# Altium project Control Board V2.PrjPcb
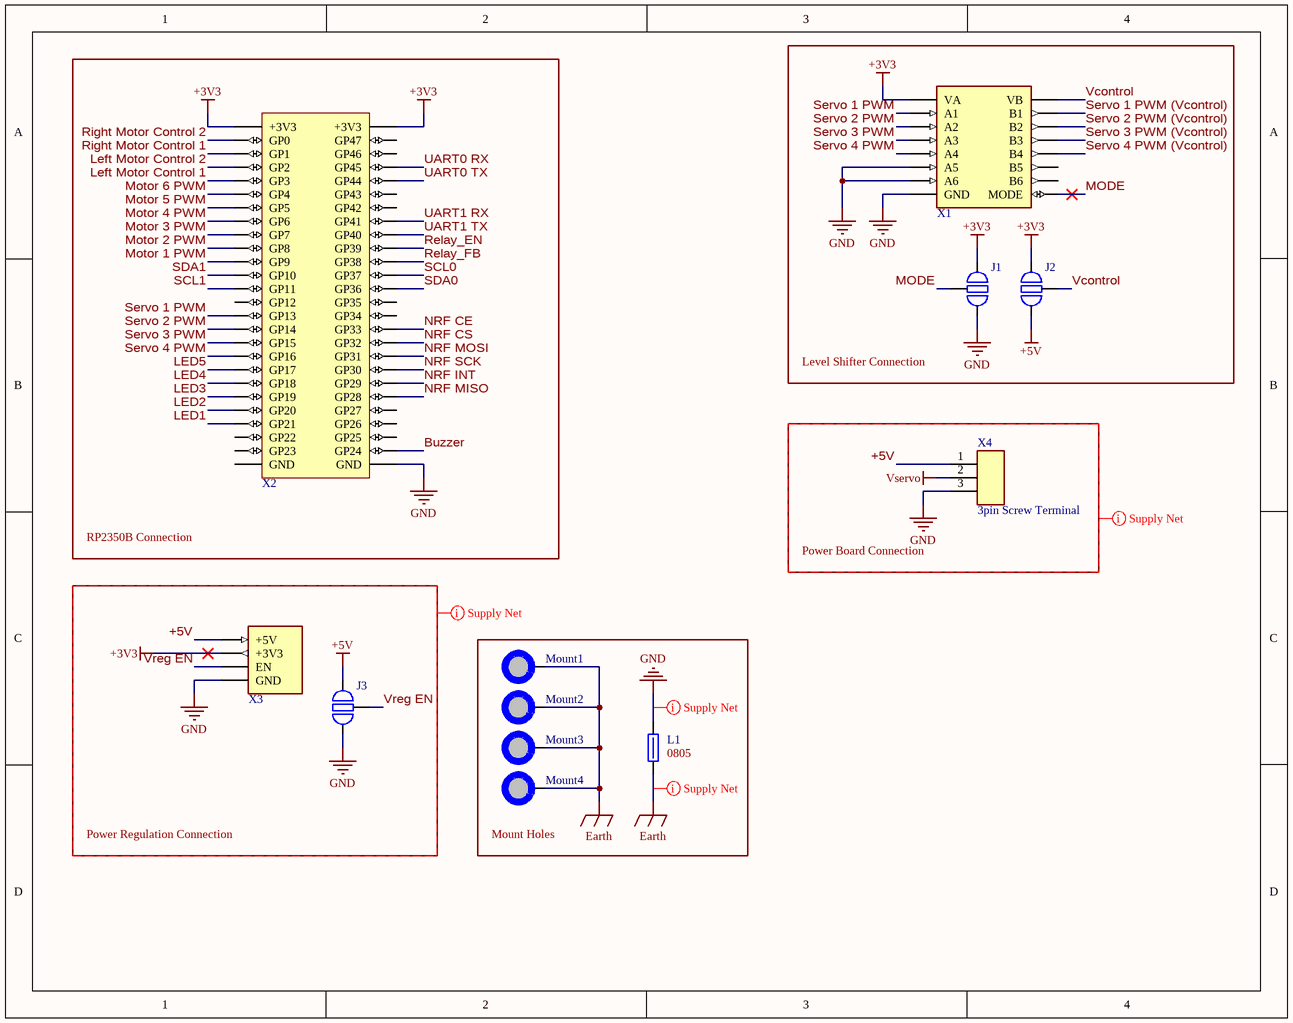
[diagram p0: Board ConnectionsSchDoc.SchDoc]
1 sheet, 12 parts. Net scope: global (net labels, ports and power ports of the same name join across sheets).
Board file: Main.PcbDoc

## Sheet Board ConnectionsSchDoc.SchDoc
size A; SheetNumber: 1; SheetTotal: 2

### Parts
J1  [Jumper] Thru-Hole 3pin  [[Jumper] Thru-Hole 3pin]  (value not drawn)  (no BOM)
J2  [Jumper] Thru-Hole 3pin  [[Jumper] Thru-Hole 3pin]  (value not drawn)  (no BOM)
J3  [Jumper] Thru-Hole 3pin  [[Jumper] Thru-Hole 3pin]  (value not drawn)  (no BOM)
L1  Size Package: 0805  [[Ferrite] SMD 0805]  (hidden comment: 652-MH2029-300Y)
Mount1  M3 Mount Hole  [[Mount] M3 Mount Hole]  (value not drawn)  (no BOM)
Mount2  M3 Mount Hole  [[Mount] M3 Mount Hole]  (value not drawn)  (no BOM)
Mount3  M3 Mount Hole  [[Mount] M3 Mount Hole]  (value not drawn)  (no BOM)
Mount4  M3 Mount Hole  [[Mount] M3 Mount Hole]  (value not drawn)  (no BOM)
X1  [Level Shifter] MC14504BDTR2G Breakout  [[Level Shifter] MC14504BDTR2G Breakout]  (value not drawn)
X2  RP2350  [[Pi] RP2350B Breakout]  (value not drawn)
X3  [Reg] 3V3 Linear Reg Breakout  [[Reg] 3V3 Linear Reg Breakout]  (value not drawn)  (no BOM)
X4  3pin Screw Terminal  [[Screw Terminal] 3pin 5mm]

### Blocks framed on the sheet
RP2350B Connection: X2
Level Shifter Connection: J1 J2 X1
Power Board Connection: X4
Power Regulation Connection: J3 X3
Mount Holes: L1 Mount1-Mount4

### Nets
+3V3: J1.1 J2.1 X1.1(VA) X2.1(+3V3) X2.52(+3V3) X3.2(+3V3)
+5V: J2.3 J3.1 X3.1(+5V) X4.1
Earth: L1.1 Mount1.1 Mount2.1 Mount3.1 Mount4.1
GND: J1.3 J3.3 L1.2 X1.6(A5) X1.7(A6) X1.8(GND) X2.27(GND) X3.4(GND) X4.3
Vservo: X4.2
Buzzer: X2.28(GP24)
LED1: X2.23(GP21)
LED2: X2.22(GP20)
LED3: X2.21(GP19)
LED4: X2.20(GP18)
LED5: X2.19(GP17)
Left Motor Control 1: X2.5(GP3)
Left Motor Control 2: X2.4(GP2)
MODE: J1.2(Common) X1.9(MODE)
Motor 1 PWM: X2.11(GP9)
Motor 2 PWM: X2.10(GP8)
Motor 3 PWM: X2.9(GP7)
Motor 4 PWM: X2.8(GP6)
Motor 5 PWM: X2.7(GP5)
Motor 6 PWM: X2.6(GP4)
NRF CE: X2.37(GP33)
NRF CS: X2.36(GP32)
NRF INT: X2.33(GP29)
NRF MISO: X2.32(GP28)
NRF MOSI: X2.35(GP31)
NRF SCK: X2.34(GP30)
Relay_EN: X2.43(GP39)
Relay_FB: X2.42(GP38)
Right Motor Control 1: X2.3(GP1)
Right Motor Control 2: X2.2(GP0)
SCL0: X2.41(GP37)
SCL1: X2.13(GP11)
SDA0: X2.40(GP36)
SDA1: X2.12(GP10)
Servo 1 PWM: X1.2(A1) X2.15(GP13)
Servo 1 PWM (Vcontrol): X1.15(B1)
Servo 2 PWM: X1.3(A2) X2.16(GP14)
Servo 2 PWM (Vcontrol): X1.14(B2)
Servo 3 PWM: X1.4(A3) X2.17(GP15)
Servo 3 PWM (Vcontrol): X1.13(B3)
Servo 4 PWM: X1.5(A4) X2.18(GP16)
Servo 4 PWM (Vcontrol): X1.12(B4)
UART0 RX: X2.49(GP45)
UART0 TX: X2.48(GP44)
UART1 RX: X2.45(GP41)
UART1 TX: X2.44(GP40)
Vcontrol: J2.2(Common) X1.16(VB)
Vreg EN: J3.2(Common) X3.3(EN)

Not connected (* = marked no-connect by the designer): X1 10(B6) 11(B5); X2 14(GP12) 24(GP22) 25(GP23) 26(GND) 29(GP25) 30(GP26) 31(GP27) 38(GP34) 39(GP35) 46(GP42) 47(GP43) 50(GP46) 51(GP47)

### Layout directives
net class Supply_Nets: +3V3, +5V, Earth, GND, Vreg EN, Vservo

### Library data of the parts
L1 = [Ferrite] SMD 0805 3A 30ohm: Res @ Freq: 30 @ 100MHz; Supplier 1: DigiKey; Supplier Part Number 1: MH2029-300YCT-ND
Mount1-Mount4 = [Mount] M3 Mount Hole: Place at least 4.5mm from board edge. Plated.
X1 = [Level Shifter] MC14504BDTR2G Breakout: Custom MIL Part; Supplier 1: DigiKey; Supplier Part Number 1: MC14504BDTR2GOSCT-ND
X2 = [Pi] RP2350B Breakout: Custom MIL Part
X3 = [Reg] 3V3 Linear Reg Breakout: Custom MIL Part
X4 = [Screw Terminal] 3pin: Supplier 1: DigiKey; Supplier Part Number 1: 102-6162-ND